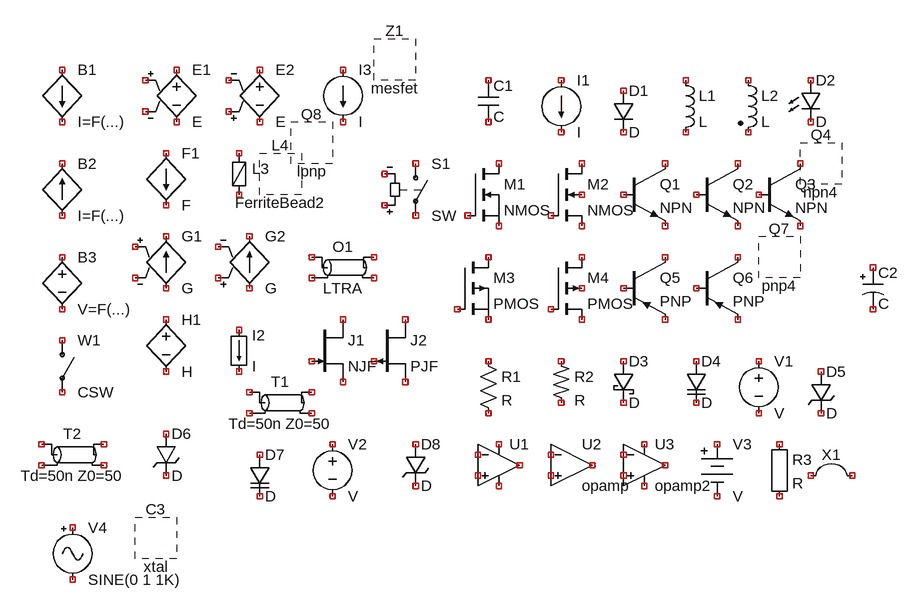
[diagram p0: schematic all_symbols_default.asc]
all_symbols_default.asc, the LTspice schematic file:
Version 4
SHEET 1 1132 920
SYMBOL cap -80 32 R0
SYMATTR InstName C1
SYMBOL current 48 32 R0
SYMATTR InstName I1
SYMBOL diode 128 48 R0
SYMATTR InstName D1
SYMBOL ind 224 16 R0
SYMATTR InstName L1
SYMBOL ind2 320 16 R0
SYMATTR InstName L2
SYMBOL LED 416 32 R0
SYMATTR InstName D2
SYMBOL nmos -96 160 R0
SYMATTR InstName M1
SYMBOL nmos4 32 160 R0
SYMATTR InstName M2
SYMBOL npn 144 160 R0
SYMATTR InstName Q1
SYMBOL npn2 256 160 R0
SYMATTR InstName Q2
SYMBOL npn3 352 160 R0
SYMATTR InstName Q3
SYMBOL npn4 448 160 R0
SYMATTR InstName Q4
SYMBOL pmos -112 304 R0
SYMATTR InstName M3
SYMBOL pmos4 32 304 R0
SYMATTR InstName M4
SYMBOL pnp 144 304 R0
SYMATTR InstName Q5
SYMBOL pnp2 256 304 R0
SYMATTR InstName Q6
SYMBOL pnp4 384 304 R0
SYMATTR InstName Q7
SYMBOL polcap 512 320 R0
SYMATTR InstName C2
SYMBOL res -80 448 R0
SYMATTR InstName R1
SYMBOL res2 32 464 R0
SYMATTR InstName R2
SYMBOL schottky 128 464 R0
SYMATTR InstName D3
SYMBOL varactor 240 464 R0
SYMATTR InstName D4
SYMBOL voltage 352 448 R0
SYMATTR InstName V1
SYMBOL zener 432 480 R0
SYMATTR InstName D5
SYMBOL bi -720 16 R0
SYMATTR InstName B1
SYMBOL bi2 -720 160 R0
SYMATTR InstName B2
SYMBOL bv -720 288 R0
SYMATTR InstName B3
SYMBOL csw -720 432 R0
SYMATTR InstName W1
SYMBOL e -544 0 R0
SYMATTR InstName E1
SYMBOL e2 -416 0 R0
SYMATTR InstName E2
SYMBOL f -560 144 R0
SYMATTR InstName F1
SYMBOL FerriteBead -448 176 R0
SYMATTR InstName L3
SYMBOL FerriteBead2 -384 176 R0
SYMATTR InstName L4
SYMBOL g -560 256 R0
SYMATTR InstName G1
SYMBOL g2 -432 256 R0
SYMATTR InstName G2
SYMBOL h -560 384 R0
SYMATTR InstName H1
SYMBOL load -464 416 R0
SYMATTR InstName I2
SYMBOL load2 -288 16 R0
SYMATTR InstName I3
SYMBOL lpnp -336 128 R0
SYMATTR InstName Q8
SYMBOL ltline -288 320 R0
SYMATTR InstName O1
SYMBOL mesfet -208 0 R0
SYMATTR InstName Z1
SYMBOL njf -336 400 R0
SYMATTR InstName J1
SYMBOL pjf -240 400 R0
SYMATTR InstName J2
SYMBOL sw -176 144 R0
SYMATTR InstName S1
SYMBOL tline -384 528 R0
SYMATTR InstName T1
SYMBOL tline -704 608 R0
SYMATTR InstName T2
SYMBOL TVSdiode -576 576 R0
SYMATTR InstName D6
SYMBOL varactor -432 608 R0
SYMATTR InstName D7
SYMBOL voltage -304 576 R0
SYMATTR InstName V2
SYMBOL zener -192 592 R0
SYMATTR InstName D8
SYMBOL Opamps/UniversalOpamp2 -48 624 R0
SYMATTR InstName U1
SYMBOL Opamps/opamp 64 560 R0
SYMATTR InstName U2
SYMBOL Opamps/opamp2 176 560 R0
SYMATTR InstName U3
SYMBOL Misc/battery 288 576 R0
SYMATTR InstName V3
SYMBOL Misc/EuropeanResistor 368 576 R0
SYMATTR InstName R3
SYMBOL Misc/jumper 464 576 R0
SYMATTR InstName X1
SYMBOL Misc/signal -704 704 R0
SYMATTR InstName V4
SYMBOL Misc/xtal -576 736 R0
SYMATTR InstName C3

The netlist it stands for:
* all_symbols_default.asc
C1 NC_01 NC_02 C
I1 NC_03 NC_04 I
D1 NC_05 NC_06 D
L1 NC_07 NC_08 L
L2 NC_09 NC_10 L
D2 NC_11 NC_12 D
M1 NC_13 NC_14 NC_15 NC_15 NMOS
M2 NC_16 NC_17 NC_18 NC_19 NMOS
Q1 NC_20 NC_21 NC_22 0 NPN
Q2 NC_23 NC_24 NC_25 0 NPN
Q3 NC_26 NC_27 NC_28 0 NPN
* Q4: npn4 (symbol npn4 not available, pin order unknown); nets seen at it: 
M3 NC_29 NC_30 NC_31 NC_31 PMOS
M4 NC_32 NC_33 NC_34 NC_35 PMOS
Q5 NC_36 NC_37 NC_38 0 PNP
Q6 NC_39 NC_40 NC_41 0 PNP
* Q7: pnp4 (symbol pnp4 not available, pin order unknown); nets seen at it: 
C2 NC_42 NC_43 C
R1 NC_44 NC_45 R
R2 NC_46 NC_47 R
D3 NC_48 NC_49 D
D4 NC_50 NC_51 D
V1 NC_52 NC_53 V
D5 NC_54 NC_55 D
B1 NC_56 NC_57 I=F(...)
B2 NC_58 NC_59 I=F(...)
B3 NC_60 NC_61 V=F(...)
W1 NC_62 NC_63 CSW
E1 NC_64 NC_65 NC_66 NC_67 E
E2 NC_68 NC_69 NC_70 NC_71 E
F1 NC_72 NC_73 F
L3 NC_74 NC_75
* L4: FerriteBead2 (symbol FerriteBead2 not available, pin order unknown); nets seen at it: 
G1 NC_76 NC_77 NC_78 NC_79 G
G2 NC_80 NC_81 NC_82 NC_83 G
H1 NC_84 NC_85 H
I2 NC_86 NC_87 I
I3 NC_88 NC_89 I
* Q8: lpnp (symbol lpnp not available, pin order unknown); nets seen at it: 
O1 NC_90 NC_91 NC_92 NC_93 LTRA
* Z1: mesfet (symbol mesfet not available, pin order unknown); nets seen at it: 
J1 NC_94 NC_95 NC_96 NJF
J2 NC_97 NC_98 NC_99 PJF
S1 NC_100 NC_101 NC_102 NC_103 SW
T1 NC_104 NC_105 NC_106 NC_107 Td=50n Z0=50
T2 NC_108 NC_109 NC_110 NC_111 Td=50n Z0=50
D6 NC_112 NC_113 D
D7 NC_114 NC_115 D
V2 NC_116 NC_117 V
D8 NC_118 NC_119 D
XU1 NC_120 NC_121 NC_122 NC_123 NC_124 level.2 Avol=1Meg GBW=10Meg Slew=10Meg ilimit=25m rail=0 Vos=0 phimargin=45 en=0 enk=0 in=0 ink=0 Rin=500Meg  ; pins IN+ IN- V+ V- OUT
XU2 NC_125 NC_126 NC_127 opamp Aol=100K GBW=10Meg  ; pins invin noninvin out
XU3 NC_128 NC_129 NC_130 NC_131 NC_132 opamp2  ; pins In+ In- V+ V- OUT
V3 NC_133 NC_134 V
R3 NC_135 NC_136 R
V4 NC_137 NC_138 SINE(0 1 1K)
* C3: xtal (symbol Misc/xtal not available, pin order unknown); nets seen at it: 
.model D D
.lib standard.dio
.model NPN NPN
.model PNP PNP
.lib standard.bjt
.model NJF NJF
.model PJF PJF
.lib standard.jft
.model NMOS NMOS
.model PMOS PMOS
.lib standard.mos
.lib UniversalOpamps2.sub
.backanno
.end